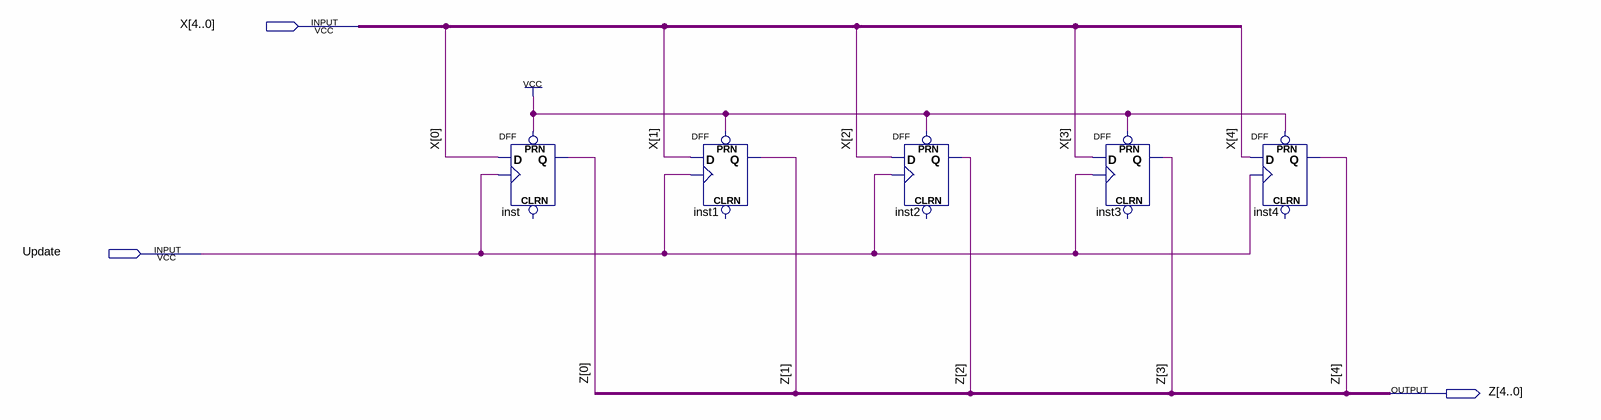
[diagram p0: schematic sheet]
// Quartus schematic register_file.bdf as structural Verilog: 5 symbols, 3 pins
module register_file (
  input  [4:0] X,
  input  Update,
  output [4:0] Z
);

  DFF inst (.CLK(Update), .D(X[0]), .PRN(1'b1), .Q(Z[0]));  // open: CLRN
  DFF inst1 (.CLK(Update), .D(X[1]), .PRN(1'b1), .Q(Z[1]));  // open: CLRN
  DFF inst2 (.CLK(Update), .D(X[2]), .PRN(1'b1), .Q(Z[2]));  // open: CLRN
  DFF inst3 (.CLK(Update), .D(X[3]), .PRN(1'b1), .Q(Z[3]));  // open: CLRN
  DFF inst4 (.CLK(Update), .D(X[4]), .PRN(1'b1), .Q(Z[4]));  // open: CLRN
endmodule
